# Altium project Crosstalk-3.PrjPcb
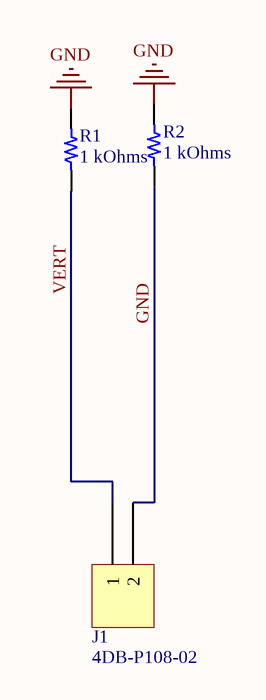
[diagram p0: crosstalk-3.SchDoc]
1 sheet, 3 parts. Net scope: global (net labels, ports and power ports of the same name join across sheets).
Board file: crosstalk-3.PcbDoc

## Sheet crosstalk-3.SchDoc
size A4; SheetNumber: 1; SheetTotal: 1

### Parts
J1  4DB-P108-02  [TE 4DB-P108-02]
R1  1 kOhms  [RES 0603_1608]
R2  1 kOhms  [RES 0603_1608]

### Nets
GND: J1.2 R1.2 R2.1 R2.2
VERT: J1.1 R1.1

### Notes on the sheet
- TITLE:
- DOCUMENT NAME:
- AUTHOR :
- REVIEWER:
- This document is created by/ for Mitai. Any further questions can be asked through
- Sheet
- PART NO.:
- of
- DATE:
- *
- TEMPLATE:
- team@mitai.ai.
- A4
- Contact Address:Rosenheimer Straße 116b,81669, München.

### Library data of the parts
J1 = 4DB-P108-02: CONN BARRIER STRIP 2CIRC 0.325"; Manufacturer: TE Connectivity AMP Connectors; Barrier Type: 2 Wall (Dual); Bottom Termination: PC Pin; Current Rating (Amps): 20A; Number of Circuits: 2; Pitch: 0.325" (8.26mm); Top Termination: Screws with Captive Plate; Voltage Rating: 150V; Wire Gauge: 12-22 AWG; Part Number: 4DB-P108-02; Color: Black; ComponentLink1Description: Datasheet; ComponentLink1URL: https://www.te.com/commerce/DocumentDelivery/DDEController?Action=srchrtrv&DocNm=2-1437667-4&DocType=Customer+Drawing&DocLang=English; ComponentLink2Description: DigiKey Link; ComponentLink2URL: http://digikey.com/product-detail/en/te-connectivity-amp-connectors/4DB-P108-02/A98472-ND/1277921; LastUpdated: 15/01/2020 04:14:08; Lifecycle Status: Active; Minimum Order: 1; Number of Rows: 1; Number of Wire Entries: 2; Packaging: Bulk; Part Status: Active; Price: 1.04; Series: 4DB, Buchanan; Supplier 1: DigiKey; Supplier Part Number 1: A98472-ND; Terminal Block Type: Barrier Block
R1 R2 = CPF0603B1K0E: RES SMD 1K OHM 0.1% 1/16W 0603; Manufacturer: TE Connectivity Passive Product; Power (Watts): 0.063W, 1/16W; Temperature Coefficient: ±25ppm/°C; Part Number: CPF0603B1K0E; Value: 1 kOhms; ComponentLink1Description: Datasheet; ComponentLink1URL: https://www.te.com/commerce/DocumentDelivery/DDEController?Action=srchrtrv&DocNm=1773200&DocType=DS&DocLang=English; ComponentLink2Description: DigiKey Link; ComponentLink2URL: https://www.digikey.com/en/products/detail/te-connectivity-passive-product/CPF0603B1K0E/2390473; Composition: Thin Film; Device Package: 0603 (1608 Metric); Height - Seated (Max): 0.022" (0.55mm); LastUpdated: 18/10/2023 19:36:15; Lifecycle Status: Active; Minimum Order: 1; Number of Terminations: 2; Operating Temperature: -55°C ~ 155°C; Package / Case: 0603 (1608 Metric); Packaging: TapeAndReel; PartId: 4877; Part Status: Active; Price: 0.09; Resistance: 1 kOhms; Series: CPF, Neohm; Size / Dimension: 0.061" L x 0.031" W (1.55mm x 0.80mm); Supplier 1: DigiKey; Supplier Part Number 1: A119887CT-ND; Supplier Device Package: 0603; Tolerance: ±0.1%